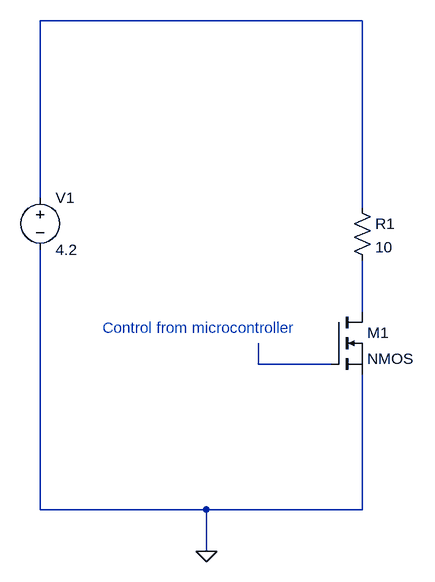
[diagram p0: schematic individual balancing circuit.asc]
individual balancing circuit.asc, the LTspice schematic file:
Version 4
SHEET 1 880 692
WIRE 672 -144 176 -144
WIRE 176 128 176 -144
WIRE 672 144 672 -144
WIRE 672 304 672 224
WIRE 512 384 512 352
WIRE 624 384 512 384
WIRE 176 608 176 208
WIRE 432 608 176 608
WIRE 672 608 672 400
WIRE 672 608 432 608
WIRE 432 672 432 608
FLAG 432 672 0
SYMBOL voltage 176 112 R0
WINDOW 123 0 0 Left 0
WINDOW 39 0 0 Left 0
SYMATTR InstName V1
SYMATTR Value 4.2
SYMBOL nmos 624 304 R0
SYMATTR InstName M1
SYMBOL res 656 128 R0
SYMATTR InstName R1
SYMATTR Value 10
TEXT 272 328 Left 2 ;Control from microcontroller

The netlist it stands for:
* individual balancing circuit.asc
V1 N001 0 4.2
M1 N002 N003 0 0 NMOS
R1 N001 N002 10
.model NMOS NMOS
.model PMOS PMOS
.lib standard.mos
* Control from microcontroller
.backanno
.end